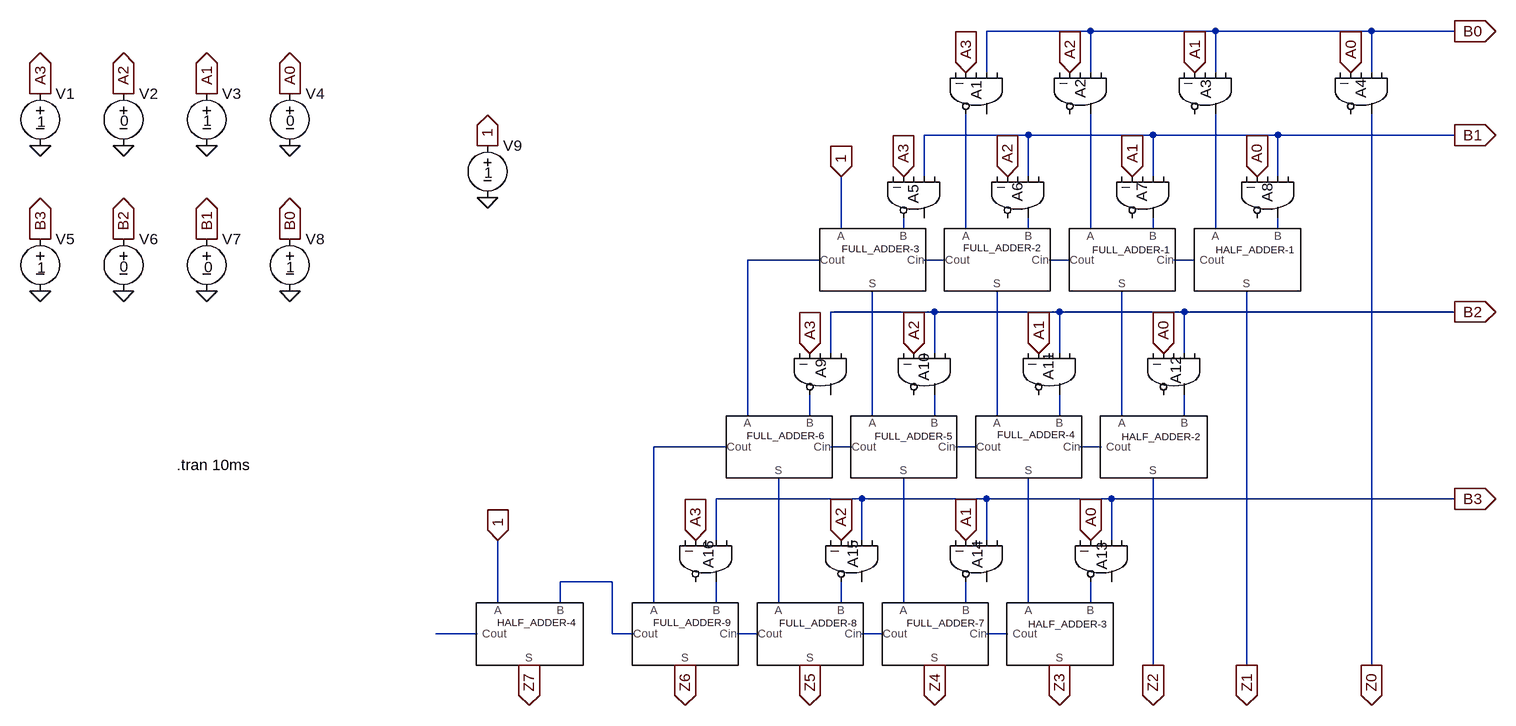
[diagram p0: schematic Bough-Wooley_Multiplier.asc]
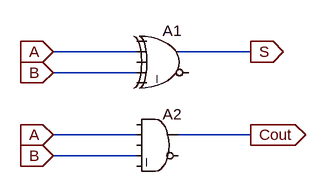
[diagram p1: sub-circuit half_adder.asc]
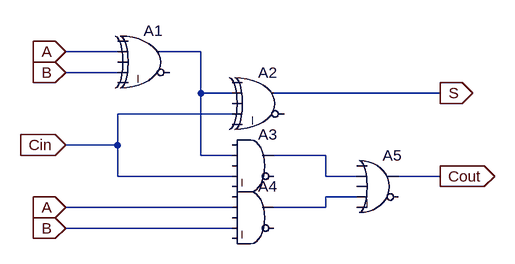
[diagram p2: sub-circuit full_adder.asc]
Bough-Wooley_Multiplier.asc, the LTspice schematic file:
Version 4
SHEET 1 880 860
WIRE 128 -224 -32 -224
WIRE 320 -224 128 -224
WIRE 560 -224 320 -224
WIRE 688 -224 560 -224
WIRE -32 -160 -32 -224
WIRE 128 -160 128 -224
WIRE 320 -160 320 -224
WIRE 560 -160 560 -224
WIRE 32 -64 -128 -64
WIRE 224 -64 32 -64
WIRE 416 -64 224 -64
WIRE 688 -64 416 -64
WIRE -128 0 -128 -64
WIRE 32 0 32 -64
WIRE 224 0 224 -64
WIRE 416 0 416 -64
WIRE -256 80 -256 0
WIRE -160 80 -160 64
WIRE -64 80 -64 -96
WIRE 32 80 32 64
WIRE 128 80 128 -96
WIRE 224 80 224 64
WIRE 320 80 320 -96
WIRE 416 80 416 64
WIRE -288 128 -400 128
WIRE -96 128 -128 128
WIRE 96 128 64 128
WIRE 288 128 256 128
WIRE -112 208 -272 208
WIRE 80 208 -112 208
WIRE 272 208 80 208
WIRE 688 208 272 208
WIRE -272 272 -272 208
WIRE -112 272 -112 208
WIRE 80 272 80 208
WIRE 272 272 272 208
WIRE -400 368 -400 128
WIRE -304 368 -304 336
WIRE -208 368 -208 176
WIRE -112 368 -112 336
WIRE -16 368 -16 176
WIRE 80 368 80 336
WIRE 176 368 176 176
WIRE 272 368 272 336
WIRE -432 416 -544 416
WIRE -240 416 -272 416
WIRE -48 416 -80 416
WIRE 144 416 112 416
WIRE -224 496 -448 496
WIRE -32 496 -224 496
WIRE 160 496 -32 496
WIRE 688 496 160 496
WIRE -448 560 -448 496
WIRE -224 560 -224 496
WIRE -32 560 -32 496
WIRE 160 560 160 496
WIRE -608 624 -688 624
WIRE -784 656 -784 560
WIRE -688 656 -688 624
WIRE -544 656 -544 416
WIRE -448 656 -448 624
WIRE -352 656 -352 464
WIRE -256 656 -256 624
WIRE -160 656 -160 464
WIRE -64 656 -64 624
WIRE 32 656 32 464
WIRE 128 656 128 624
WIRE -816 704 -880 704
WIRE -608 704 -608 624
WIRE -576 704 -608 704
WIRE -384 704 -416 704
WIRE -192 704 -224 704
WIRE 0 704 -32 704
WIRE 224 752 224 464
WIRE 368 752 368 176
WIRE 560 752 560 -96
FLAG -160 0 A3
IOPIN -160 0 In
FLAG 0 0 A2
IOPIN 0 0 In
FLAG 192 0 A1
IOPIN 192 0 In
FLAG 384 0 A0
IOPIN 384 0 In
FLAG -64 -160 A3
IOPIN -64 -160 In
FLAG 96 -160 A2
IOPIN 96 -160 In
FLAG 288 -160 A1
IOPIN 288 -160 In
FLAG 528 -160 A0
IOPIN 528 -160 In
FLAG -256 0 1
IOPIN -256 0 In
FLAG -304 272 A3
IOPIN -304 272 In
FLAG -144 272 A2
IOPIN -144 272 In
FLAG 48 272 A1
IOPIN 48 272 In
FLAG 240 272 A0
IOPIN 240 272 In
FLAG -480 560 A3
IOPIN -480 560 In
FLAG -256 560 A2
IOPIN -256 560 In
FLAG -64 560 A1
IOPIN -64 560 In
FLAG 128 560 A0
IOPIN 128 560 In
FLAG -784 560 1
IOPIN -784 560 In
FLAG 688 -224 B0
IOPIN 688 -224 Out
FLAG 688 -64 B1
IOPIN 688 -64 Out
FLAG 688 208 B2
IOPIN 688 208 Out
FLAG 688 496 B3
IOPIN 688 496 Out
FLAG 560 752 Z0
IOPIN 560 752 Out
FLAG 368 752 Z1
IOPIN 368 752 Out
FLAG 224 752 Z2
IOPIN 224 752 Out
FLAG 80 752 Z3
IOPIN 80 752 Out
FLAG -112 752 Z4
IOPIN -112 752 Out
FLAG -304 752 Z5
IOPIN -304 752 Out
FLAG -496 752 Z6
IOPIN -496 752 Out
FLAG -736 752 Z7
IOPIN -736 752 Out
FLAG -1488 -48 0
FLAG -1360 -48 0
FLAG -1232 -48 0
FLAG -1104 -48 0
FLAG -1104 176 0
FLAG -1232 176 0
FLAG -1360 176 0
FLAG -1488 176 0
FLAG -1488 -128 A3
IOPIN -1488 -128 Out
FLAG -1360 -128 A2
IOPIN -1360 -128 Out
FLAG -1232 -128 A1
IOPIN -1232 -128 Out
FLAG -1104 -128 A0
IOPIN -1104 -128 Out
FLAG -1104 96 B0
IOPIN -1104 96 Out
FLAG -1232 96 B1
IOPIN -1232 96 Out
FLAG -1360 96 B2
IOPIN -1360 96 Out
FLAG -1488 96 B3
IOPIN -1488 96 Out
FLAG -800 32 0
FLAG -800 -48 1
IOPIN -800 -48 Out
SYMBOL Half_Adder 368 128 R0
SYMATTR InstName HALF_ADDER-1
SYMBOL Full_Adder 176 128 R0
WINDOW 0 -46 -16 Left 1
SYMATTR InstName FULL_ADDER-1
SYMBOL Full_Adder -16 128 R0
WINDOW 0 -52 -19 Left 1
SYMATTR InstName FULL_ADDER-2
SYMBOL Full_Adder -208 128 R0
WINDOW 0 -47 -17 Left 1
SYMATTR InstName FULL_ADDER-3
SYMBOL Digital\\and 16 -128 R90
WINDOW 0 -20 64 Left 2
SYMATTR InstName A1
SYMBOL Digital\\and 176 -128 R90
WINDOW 0 -22 64 Left 2
SYMATTR InstName A2
SYMBOL Digital\\and 368 -128 R90
WINDOW 0 -21 63 Left 2
SYMATTR InstName A3
SYMBOL Digital\\and 608 -128 R90
WINDOW 0 -22 64 Left 2
SYMATTR InstName A4
SYMBOL Digital\\and -80 32 R90
WINDOW 0 -20 65 Left 2
SYMATTR InstName A5
SYMBOL Digital\\and 80 32 R90
WINDOW 0 -23 65 Left 2
SYMATTR InstName A6
SYMBOL Digital\\and 272 32 R90
WINDOW 0 -23 65 Left 2
SYMATTR InstName A7
SYMBOL Digital\\and 464 32 R90
WINDOW 0 -22 64 Left 2
SYMATTR InstName A8
SYMBOL Half_Adder 224 416 R0
SYMATTR InstName HALF_ADDER-2
SYMBOL Full_Adder 32 416 R0
WINDOW 0 -48 -19 Left 1
SYMATTR InstName FULL_ADDER-4
SYMBOL Full_Adder -160 416 R0
WINDOW 0 -44 -17 Left 1
SYMATTR InstName FULL_ADDER-5
SYMBOL Full_Adder -352 416 R0
WINDOW 0 -49 -18 Left 1
SYMATTR InstName FULL_ADDER-6
SYMBOL Digital\\and -224 304 R90
WINDOW 0 -23 63 Left 2
SYMATTR InstName A9
SYMBOL Digital\\and -64 304 R90
WINDOW 0 -32 65 Left 2
SYMATTR InstName A10
SYMBOL Digital\\and 128 304 R90
WINDOW 0 -33 65 Left 2
SYMATTR InstName A11
SYMBOL Digital\\and 320 304 R90
WINDOW 0 -27 61 Left 2
SYMATTR InstName A12
SYMBOL Half_Adder 80 704 R0
SYMATTR InstName HALF_ADDER-3
SYMBOL Full_Adder -112 704 R0
WINDOW 0 -43 -17 Left 1
SYMATTR InstName FULL_ADDER-7
SYMBOL Full_Adder -304 704 R0
WINDOW 0 -47 -17 Left 1
SYMATTR InstName FULL_ADDER-8
SYMBOL Full_Adder -496 704 R0
WINDOW 0 -49 -18 Left 1
SYMATTR InstName FULL_ADDER-9
SYMBOL Half_Adder -736 704 R0
WINDOW 0 -49 -18 Left 1
SYMATTR InstName HALF_ADDER-4
SYMBOL Digital\\and 208 592 R90
WINDOW 0 -29 63 Left 2
SYMATTR InstName A13
SYMBOL Digital\\and 16 592 R90
WINDOW 0 -31 62 Left 2
SYMATTR InstName A14
SYMBOL Digital\\and -176 592 R90
WINDOW 0 -32 62 Left 2
SYMATTR InstName A15
SYMBOL Digital\\and -400 592 R90
WINDOW 0 -31 60 Left 2
SYMATTR InstName A16
SYMBOL voltage -1488 -144 R0
WINDOW 3 -5 59 Left 2
WINDOW 123 0 0 Left 0
WINDOW 39 0 0 Left 0
SYMATTR Value 1
SYMATTR InstName V1
SYMBOL voltage -1360 -144 R0
WINDOW 3 -5 58 Left 2
WINDOW 123 0 0 Left 0
WINDOW 39 0 0 Left 0
SYMATTR Value 0
SYMATTR InstName V2
SYMBOL voltage -1232 -144 R0
WINDOW 3 -5 58 Left 2
WINDOW 123 0 0 Left 0
WINDOW 39 0 0 Left 0
SYMATTR Value 1
SYMATTR InstName V3
SYMBOL voltage -1104 -144 R0
WINDOW 3 -6 58 Left 2
WINDOW 123 0 0 Left 0
WINDOW 39 0 0 Left 0
SYMATTR Value 0
SYMATTR InstName V4
SYMBOL voltage -1488 80 R0
WINDOW 3 -5 60 Left 2
WINDOW 123 0 0 Left 0
WINDOW 39 0 0 Left 0
SYMATTR Value 1
SYMATTR InstName V5
SYMBOL voltage -1360 80 R0
WINDOW 3 -6 58 Left 2
WINDOW 123 0 0 Left 0
WINDOW 39 0 0 Left 0
SYMATTR Value 0
SYMATTR InstName V6
SYMBOL voltage -1232 80 R0
WINDOW 3 -4 59 Left 2
WINDOW 123 0 0 Left 0
WINDOW 39 0 0 Left 0
SYMATTR Value 0
SYMATTR InstName V7
SYMBOL voltage -1104 80 R0
WINDOW 3 -6 59 Left 2
WINDOW 123 0 0 Left 0
WINDOW 39 0 0 Left 0
SYMATTR Value 1
SYMATTR InstName V8
SYMBOL voltage -800 -64 R0
WINDOW 3 -5 58 Left 2
WINDOW 123 0 0 Left 0
WINDOW 39 0 0 Left 0
SYMATTR InstName V9
SYMATTR Value 1
TEXT -1278 444 Left 2 !.tran 10ms

half_adder.asc, the sub-circuit schematic file:
Version 4
SHEET 1 880 680
WIRE 128 80 0 80
WIRE 304 80 192 80
WIRE 128 112 0 112
WIRE 128 208 0 208
WIRE 304 208 192 208
WIRE 128 240 0 240
FLAG 0 80 A
IOPIN 0 80 In
FLAG 0 208 A
IOPIN 0 208 In
FLAG 0 112 B
IOPIN 0 112 In
FLAG 0 240 B
IOPIN 0 240 In
FLAG 304 80 S
IOPIN 304 80 Out
FLAG 304 208 Cout
IOPIN 304 208 Out
SYMBOL Digital\\xor 176 32 R0
SYMATTR InstName A1
SYMBOL Digital\\and 160 160 R0
SYMATTR InstName A2

full_adder.asc, the sub-circuit schematic file:
Version 4
SHEET 1 880 680
WIRE 64 48 -16 48
WIRE 192 48 128 48
WIRE 64 80 -16 80
WIRE 192 112 192 48
WIRE 240 112 192 112
WIRE 560 112 304 112
WIRE 240 144 64 144
WIRE 64 192 64 144
WIRE 64 192 -16 192
WIRE 192 208 192 112
WIRE 240 208 192 208
WIRE 384 208 304 208
WIRE 64 240 64 192
WIRE 240 240 64 240
WIRE 384 240 384 208
WIRE 432 240 384 240
WIRE 560 240 496 240
WIRE 432 272 384 272
WIRE 240 288 -16 288
WIRE 384 288 384 272
WIRE 384 288 304 288
WIRE 240 320 -16 320
FLAG -16 48 A
IOPIN -16 48 In
FLAG -16 80 B
IOPIN -16 80 In
FLAG -16 192 Cin
IOPIN -16 192 In
FLAG -16 288 A
IOPIN -16 288 In
FLAG -16 320 B
IOPIN -16 320 In
FLAG 560 112 S
IOPIN 560 112 Out
FLAG 560 240 Cout
IOPIN 560 240 Out
SYMBOL Digital\\xor 112 0 R0
SYMATTR InstName A1
SYMBOL Digital\\xor 288 64 R0
SYMATTR InstName A2
SYMBOL Digital\\and 272 160 R0
SYMATTR InstName A3
SYMBOL Digital\\and 272 240 R0
SYMATTR InstName A4
SYMBOL Digital\\or 464 192 R0
SYMATTR InstName A5

The netlist it stands for:
* Bough-Wooley_Multiplier.asc
XHALF_ADDER-1 N006 N007 N011 Z1 half_adder
XFULL_ADDER-1 N004 N005 N010 N011 N017 full_adder
XFULL_ADDER-2 N002 N003 N009 N010 N015 full_adder
XFULL_ADDER-3 1 N001 N008 N009 N013 full_adder
A1 0 B0 0 A3 0 N002 0 0 AND
A2 0 B0 0 A2 0 0 N004 0 AND
A3 0 B0 0 A1 0 0 N006 0 AND
A4 0 B0 0 A0 0 0 Z0 0 AND
A5 0 B1 0 A3 0 N001 0 0 AND
A6 0 B1 0 A2 0 0 N003 0 AND
A7 0 B1 0 A1 0 0 N005 0 AND
A8 0 B1 0 A0 0 0 N007 0 AND
XHALF_ADDER-2 N017 N018 N022 Z2 half_adder
XFULL_ADDER-4 N015 N016 N021 N022 N029 full_adder
XFULL_ADDER-5 N013 N014 N020 N021 N027 full_adder
XFULL_ADDER-6 N008 N012 N019 N020 N025 full_adder
A9 0 B2 0 A3 0 N012 0 0 AND
A10 0 B2 0 A2 0 0 N014 0 AND
A11 0 B2 0 A1 0 0 N016 0 AND
A12 0 B2 0 A0 0 0 N018 0 AND
XHALF_ADDER-3 N029 N030 N034 Z3 half_adder
XFULL_ADDER-7 N027 N028 N033 N034 Z4 full_adder
XFULL_ADDER-8 N025 N026 N032 N033 Z5 full_adder
XFULL_ADDER-9 N019 N024 N023 N032 Z6 full_adder
XHALF_ADDER-4 1 N023 N031 Z7 half_adder
A13 0 B3 0 A0 0 N030 0 0 AND
A14 0 B3 0 A1 0 N028 0 0 AND
A15 0 B3 0 A2 0 N026 0 0 AND
A16 0 B3 0 A3 0 0 N024 0 AND
V1 A3 0 1
V2 A2 0 0
V3 A1 0 1
V4 A0 0 0
V5 B3 0 1
V6 B2 0 0
V7 B1 0 0
V8 B0 0 1
V9 1 0 1

* block symbol definitions
.subckt half_adder A B Cout S
A1 0 A 0 B 0 0 S 0 XOR
A2 0 A 0 B 0 0 Cout 0 AND
.ends half_adder

.subckt full_adder A B Cout Cin S
A1 0 A 0 B 0 0 N001 0 XOR
A2 0 N001 0 Cin 0 0 S 0 XOR
A3 0 N001 0 Cin 0 0 N002 0 AND
A4 0 A 0 B 0 0 N003 0 AND
A5 0 N002 0 N003 0 0 Cout 0 OR
.ends full_adder

.tran 10ms
.backanno
.end